# Altium schematic sheet Power.SchDoc
size A4; SheetNumber: 6; SheetTotal: 7
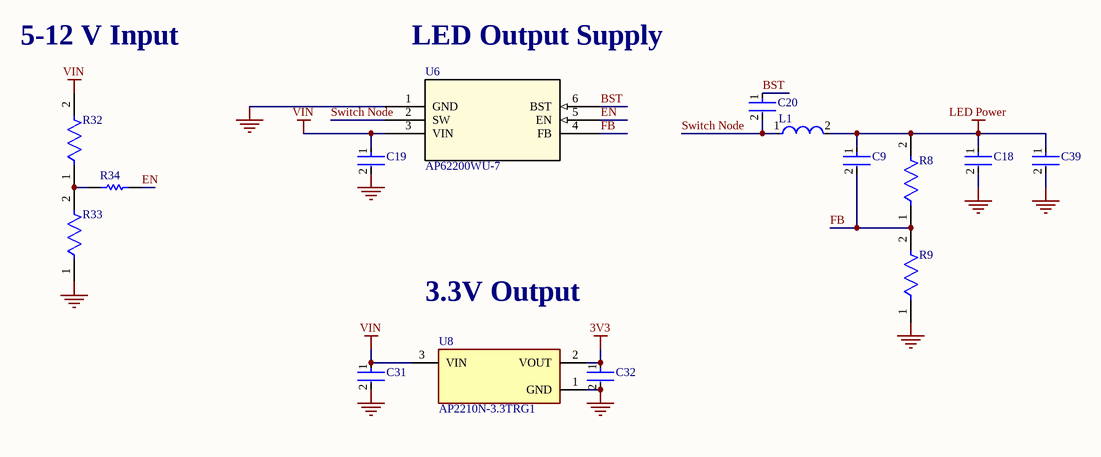
[diagram p0: Power.SchDoc]

## Parts
C9  UMK105CG330JVHF  [FP-0402-L_1_0_0_05-W_0_5-MFG]  (value not drawn)
C18  EMK316BB7226ML-T  [FP-1206-L_3_2_0_3-W_1_6_0-IPC_A]  (value not drawn)
C19  CL21A106KAYNNNE  [FP-CL21-IPC_A]  (value not drawn)
C20  GRM155R71C224KA12D  [FP-GRM155-0_05-IPC_C]  (value not drawn)
C31  GCM21BR71H105MA03L  [FP-GCM21B-0_15-MFG]  (value not drawn)
C32  GCJ21BR71E225KA01L  [FP-GCJ21B-0_3-MFG]  (value not drawn)
C39  EMK316BB7226ML-T  [FP-1206-L_3_2_0_3-W_1_6_0-IPC_A]  (value not drawn)
L1  LQM21PN4R7MGHL  [FP-LQM21PH_G0-IPC_B]  (value not drawn)
R8  ESR10EZPF5232  [FP-ESR10-MFG]  (value not drawn)
R9  AT0805DRE0710KL  [FP-AT0805-MFG]  (value not drawn)
R32  AC0402JR-07200KL  [FP-AC0402-IPC_B]  (value not drawn)
R33  CRCW040250K0FKED  [FP-CRCW0402-e3-IPC_A]  (value not drawn)
R34  RC0402JR-070RL  [RESC1005X40X25NL05T10]  (value not drawn)
U6  AP62200WU-7  [TSOT26-WU_DIO]
U8  AP2210N-3.3TRG1  [FP-SOT23-IPC_C]

## Nets
3V3: C32.1 U8.2(VOUT)
GND: C18.2 C19.2 C31.2 C32.2 C39.2 R9.1 R33.1 U6.1(GND) U8.1(GND)
LED Power: C9.1 C18.1 C39.1 L1.2 R8.2
VIN: C19.1 C31.1 R32.2 U6.3(VIN) U8.3(VIN)
BST: C20.1 U6.6(BST)
EN: R34.2 U6.5(EN)
FB: C9.2 R8.1 R9.2 U6.4(FB)
Switch Node: C20.2 L1.1 U6.2(SW)
NetR32_1: R32.1 R33.2 R34.1

## Notes on the sheet
- 5-12 V Input
- LED Output Supply
- 3.3V Output

## Library data of the parts
C9 = CMP-14477-003555-2: None; Voltage Rating (DC): 50V; Tolerance: 5%; Capacitance: 33pF; Mount: Surface Mount; Case Code (Imperial): 0402; Min Operating Temperature: -55°C; Package Quantity: 10000; Halogen Free: Halogen Free; Voltage Rating: 50V; Packaging: Tape and Reel; Thickness: 0.022inch; Ratings: AEC-Q200; Case/Package: 0402; RoHS Compliant: Yes; Length: 0.039inch; Width: 0.02inch; Case Code (Metric): 1005; Max Operating Temperature: 125°C
C18 C39 = CMP-14477-000099-2: None; Tolerance: 20%; Voltage Rating: 16V; Capacitance: 22uF; Dielectric: X7R; Lead Free: Lead Free; Min Operating Temperature: -55°C; Max Operating Temperature: 125°C; Case/Package: 1206; RoHS Compliant: Yes; Case Code (Metric): 3216; Width: 0.063inch; Case Code (Imperial): 1206; Thickness: 0.071inch; Packaging: Tape and Reel; Length: 0.126inch; Mount: Surface Mount
C19 = CMP-13271-002975-1: CL21 Series 0805 10uF 25V ±10% Tolerance X5R Multilayer Ceramic Chip Capacitor; Case Code (Imperial): 0805; Length: 2mm; Case/Package: 0805; Packaging: Tape and Reel; Width: 0.049inch; Tolerance: 10%; Mount: Surface Mount; Min Operating Temperature: -55°C; Thickness: 0.057inch; Height: 1.25mm; Dielectric: X5R; Package Quantity: 1; Depth: 1.25mm; Capacitance: 10uF; Voltage Rating: 25V; Case Code (Metric): 2012; Max Operating Temperature: 85°C; Radiation Hardening: No
C20 = CMP-1034-02089-3: Chip Multilayer Ceramic Capacitors for General Purpose, 0402, 0.22uF, X7R, 15%, 10%, 16V; Capacitance: 220nF; Depth: 0.5mm; Dielectric: X7R; Min Operating Temperature: -55°C; Package Quantity: 1; Termination: SMD/SMT; Mount: Surface Mount; Radiation Hardening: No; Height: 0.5mm; Case Code (Metric): 1005; Packaging: Tape and Reel; Material: Ceramic; Voltage: 16V; Voltage Rating (DC): 16V; REACH SVHC: No SVHC; Voltage Rating: 16V; Length: 1mm; Tolerance: 10%; Thickness: 0.022inch; Case Code (Imperial): 0402; Max Operating Temperature: 125°C; Width: 0.02inch; Lead Free: Lead Free; Case/Package: 0402
C31 = CMP-06035-008660-1: Ceramic Capacitor for Automotive 1uF ±20% 50VDC X7R 0805 Embossed T/R
C32 = CMP-06035-015979-1: Multilayer Ceramic Capacitors MLCC - SMD/SMT 0805 2.2uF 10%, 25VDC,  X7R 15%
L1 = CMP-06042-016464-1: Multilayer Type Inductor for Power Lines, 0805 (2012), 4.7μH, 20%, 0.275Ω, 1.2A; Self Resonant Frequency: 20MHz; DC Resistance (DCR): 275mR; Test Frequency: 1MHz; Shielding: Shielded; Core Material: Ferrite; Saturation Current: 250mA; Inductance: 4.7uH; Ratings: AEC-Q200; Case Code (Imperial): 0805; Current Rating: 1.2A; Tolerance: 20%; Min Operating Temperature: -40°C; Mount: Surface Mount; RoHS Compliant: Yes; Case Code (Metric): 2012; Case/Package: 0805; Packaging: Tape and Reel; Max Operating Temperature: 85°C
R8 = CMP-08839-029105-1: 52.3kΩ ±1% 0.4W 0805 Anti-Surge Chip Resistor AEC-Q200; Temperature Coefficient: 100ppm/°C; Max Power Dissipation: 400mW; Resistance: 52.3kR; Min Operating Temperature: -55°C; Number of Terminations: 2; RoHS Compliant: Yes; Package Quantity: 5000; Case/Package: 0805; Height: 0.026inch; Width: 0.049inch; Features: Automotive AEC-Q200; Packaging: Tape and Reel; Length: 0.079inch; Series: ESR10; Max Operating Temperature: 155°C; Tolerance: 1%; Resistor Type: Thick Film
R9 = CMP-03412-049031-1: Thin Film Chip Resistors Automotive Grade 10kΩ 0.5% 50ppm/°C 0805; Max Power Dissipation: 125mW; Resistance: 10kR; Ratings: AEC-Q200; Length: 0.079inch; Temperature Coefficient: 50ppm/°C; Height: 0.024inch; Min Operating Temperature: -55°C; Case/Package: 0805; Tolerance: 0.5%; RoHS Compliant: Yes; Features: Moisture Resistant; Number of Terminations: 2; Max Operating Temperature: 155°C; Series: AT; Packaging: Tape and Reel; Width: 0.049inch; Resistor Type: Thin Film
R32 = CMP-03412-037959-1: RES 200kΩ ±5% 0.063W 0402; Power Rating: 62.5mW; Max Power Dissipation: 63mW; Resistance: 200kR; Temperature Coefficient: 100ppm/°C; Voltage Rating: 50V; Width: 0.5mm; Packaging: Tape and Reel; Termination: SMD/SMT; Case Code (Imperial): 0402; Features: Moisture Resistant; Case/Package: 0402; RoHS Compliant: Yes; Series: AC; Tolerance: 5%; Case Code (Metric): 1005; Height: 0.015inch; Resistor Type: Thick Film; Max Operating Temperature: 155°C; Length: 0.039inch; Number of Terminations: 2; Min Operating Temperature: -55°C
R33 = CMP-02407-005152-1: RES Thick Film, 50kΩ, 1%, 0.063W, 100ppm/°C, 0402; Power Rating: 63mW; Voltage Rating: 50V; Resistance: 50kR; Package Quantity: 10000; Case/Package: 0402; Max Operating Temperature: 155°C; Case Code (Metric): 1005; Termination: SMD/SMT; Lead Free: Lead Free; Height: 0.35mm; Width: 0.5mm; Packaging: Tape and Reel; Min Operating Temperature: -55°C; Length: 1mm; Tolerance: 1%; Case Code (Imperial): 0402; Weight: 2.3E-05oz
R34 = CMP-1011-00001-2: RES 0 OHM JUMPER 1/16W 0402; Manufacturer: Yageo / Phycomp; Part Number: RC0402JR-070RL
U6 = AP62200WU-7: No Description Available; Manufacturer_Name: Diodes Inc; Copyright: Copyright (C) 2026 Ultra Librarian. All rights reserved.; Manufacturer_Part_Number: AP62200WU-7; RefDes: RefDes; Type: Type
U8 = CMP-12756-000036-1: IC REG LINEAR 3.3V 300MA SOT23-3; Accuracy: 1%; Max Input Voltage: 13.2V; Number of Outputs: 1; Polarity: Positive; Power Supply Rejection Ratio (PSRR): 75dB; Quiescent Current: 150uA; Min Input Voltage: 2.5V; Output Type: Fixed; Dropout Voltage: 250mV; Height: 1.3mm; Weight: 0.000282oz; Packaging: Tape and Reel; Length: 3.02mm; Width: 1.7mm; Max Operating Temperature: 125°C; Output Voltage: 3.3V; Min Operating Temperature: -40°C; Output Current: 300mA; Number of Pins: 3; Number of Regulators: 1; Max Output Current: 300mA; Mount: Surface Mount; Case/Package: SOT-23-3; Package Quantity: 3000